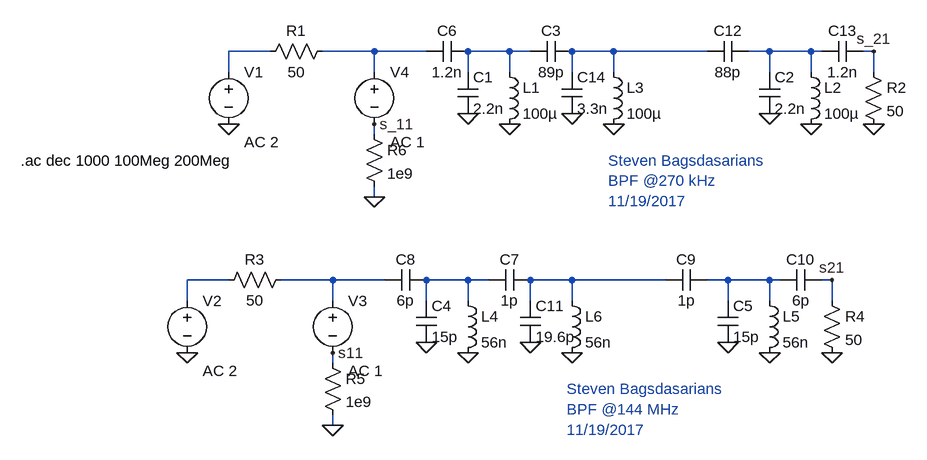
[diagram p0: schematic BPF_144MHz.asc]
BPF_144MHz.asc, the LTspice schematic file:
Version 4
SHEET 1 988 680
WIRE -96 -48 -160 -48
WIRE 64 -48 -16 -48
WIRE 144 -48 64 -48
WIRE 272 -48 208 -48
WIRE 304 -48 272 -48
WIRE 432 -48 368 -48
WIRE 576 -48 432 -48
WIRE 672 -48 640 -48
WIRE 736 -48 672 -48
WIRE 752 -48 736 -48
WIRE 832 -48 816 -48
WIRE -160 -16 -160 -48
WIRE 64 -16 64 -48
WIRE 208 -16 208 -48
WIRE 272 -16 272 -48
WIRE 368 -16 368 -48
WIRE 432 -16 432 -48
WIRE 672 -16 672 -48
WIRE 736 -16 736 -48
WIRE 832 -16 832 -48
WIRE 64 80 64 64
WIRE 64 176 64 160
WIRE -160 304 -224 304
WIRE 0 304 -80 304
WIRE 80 304 0 304
WIRE 208 304 144 304
WIRE 240 304 208 304
WIRE 368 304 304 304
WIRE 512 304 368 304
WIRE 608 304 576 304
WIRE 672 304 608 304
WIRE 688 304 672 304
WIRE 768 304 752 304
WIRE -224 336 -224 304
WIRE 0 336 0 304
WIRE 144 336 144 304
WIRE 208 336 208 304
WIRE 304 336 304 304
WIRE 368 336 368 304
WIRE 608 336 608 304
WIRE 672 336 672 304
WIRE 768 336 768 304
WIRE 0 432 0 416
WIRE 0 528 0 512
FLAG -224 416 0
FLAG 144 400 0
FLAG 208 416 0
FLAG 608 400 0
FLAG 672 416 0
FLAG 768 416 0
FLAG 304 400 0
FLAG 368 416 0
FLAG 0 528 0
FLAG 0 416 s11
FLAG 768 304 s21
FLAG -160 64 0
FLAG 208 48 0
FLAG 272 64 0
FLAG 672 48 0
FLAG 736 64 0
FLAG 832 64 0
FLAG 368 48 0
FLAG 432 64 0
FLAG 64 176 0
FLAG 64 64 s_11
FLAG 832 -48 s_21
SYMBOL ind 192 320 R0
SYMATTR InstName L4
SYMATTR Value 56n
SYMBOL ind 656 320 R0
SYMATTR InstName L5
SYMATTR Value 56n
SYMBOL cap 128 336 R0
SYMATTR InstName C4
SYMATTR Value 15p
SYMBOL cap 592 336 R0
SYMATTR InstName C5
SYMATTR Value 15p
SYMBOL res -176 320 R270
WINDOW 0 32 56 VTop 2
WINDOW 3 0 56 VBottom 2
SYMATTR InstName R3
SYMATTR Value 50
SYMBOL res 752 320 R0
SYMATTR InstName R4
SYMATTR Value 50
SYMBOL voltage -224 320 R0
WINDOW 123 24 124 Left 2
WINDOW 39 0 0 Left 2
SYMATTR Value2 AC 2
SYMATTR InstName V2
SYMATTR Value ""
SYMBOL cap 240 320 R270
WINDOW 0 32 32 VTop 2
WINDOW 3 0 32 VBottom 2
SYMATTR InstName C7
SYMATTR Value 1p
SYMBOL cap 80 320 R270
WINDOW 0 32 32 VTop 2
WINDOW 3 0 32 VBottom 2
SYMATTR InstName C8
SYMATTR Value 6p
SYMBOL cap 512 320 R270
WINDOW 0 32 32 VTop 2
WINDOW 3 0 32 VBottom 2
SYMATTR InstName C9
SYMATTR Value 1p
SYMBOL cap 688 320 R270
WINDOW 0 32 32 VTop 2
WINDOW 3 0 32 VBottom 2
SYMATTR InstName C10
SYMATTR Value 6p
SYMBOL ind 352 320 R0
SYMATTR InstName L6
SYMATTR Value 56n
SYMBOL cap 288 336 R0
SYMATTR InstName C11
SYMATTR Value 19.6p
SYMBOL voltage 0 320 R0
WINDOW 123 24 124 Left 2
WINDOW 39 0 0 Left 2
SYMATTR Value2 AC 1
SYMATTR InstName V3
SYMATTR Value ""
SYMBOL res -16 416 R0
SYMATTR InstName R5
SYMATTR Value 1e9
SYMBOL ind 256 -32 R0
SYMATTR InstName L1
SYMATTR Value 100µ
SYMBOL ind 720 -32 R0
SYMATTR InstName L2
SYMATTR Value 100µ
SYMBOL cap 192 -16 R0
SYMATTR InstName C1
SYMATTR Value 2.2n
SYMBOL cap 656 -16 R0
SYMATTR InstName C2
SYMATTR Value 2.2n
SYMBOL res -112 -32 R270
WINDOW 0 32 56 VTop 2
WINDOW 3 0 56 VBottom 2
SYMATTR InstName R1
SYMATTR Value 50
SYMBOL res 816 -32 R0
SYMATTR InstName R2
SYMATTR Value 50
SYMBOL voltage -160 -32 R0
WINDOW 123 24 124 Left 2
WINDOW 39 0 0 Left 2
SYMATTR Value2 AC 2
SYMATTR InstName V1
SYMATTR Value ""
SYMBOL cap 304 -32 R270
WINDOW 0 32 32 VTop 2
WINDOW 3 0 32 VBottom 2
SYMATTR InstName C3
SYMATTR Value 89p
SYMBOL cap 144 -32 R270
WINDOW 0 32 32 VTop 2
WINDOW 3 0 32 VBottom 2
SYMATTR InstName C6
SYMATTR Value 1.2n
SYMBOL cap 576 -32 R270
WINDOW 0 32 32 VTop 2
WINDOW 3 0 32 VBottom 2
SYMATTR InstName C12
SYMATTR Value 88p
SYMBOL cap 752 -32 R270
WINDOW 0 32 32 VTop 2
WINDOW 3 0 32 VBottom 2
SYMATTR InstName C13
SYMATTR Value 1.2n
SYMBOL ind 416 -32 R0
SYMATTR InstName L3
SYMATTR Value 100µ
SYMBOL cap 352 -16 R0
SYMATTR InstName C14
SYMATTR Value 3.3n
SYMBOL voltage 64 -32 R0
WINDOW 123 24 124 Left 2
WINDOW 39 0 0 Left 2
SYMATTR Value2 AC 1
SYMATTR InstName V4
SYMATTR Value ""
SYMBOL res 48 64 R0
SYMATTR InstName R6
SYMATTR Value 1e9
TEXT -480 120 Left 2 !.ac dec 1000 100Meg 200Meg
TEXT 360 472 Left 2 ;Steven Bagsdasarians\nBPF @144 MHz\n11/19/2017
TEXT 424 120 Left 2 ;Steven Bagsdasarians\nBPF @270 kHz\n11/19/2017

The netlist it stands for:
* BPF_144MHz.asc
L4 N008 0 56n
L5 N010 0 56n
C4 N008 0 15p
C5 N010 0 15p
R3 N006 N007 50
R4 s21 0 50
V2 N006 0 AC 2
C7 N008 N009 1p
C8 N007 N008 6p
C9 N009 N010 1p
C10 N010 s21 6p
L6 N009 0 56n
C11 N009 0 19.6p
V3 N007 s11 AC 1
R5 s11 0 1e9
L1 N003 0 100µ
L2 N005 0 100µ
C1 N003 0 2.2n
C2 N005 0 2.2n
R1 N001 N002 50
R2 s_21 0 50
V1 N001 0 AC 2
C3 N003 N004 89p
C6 N002 N003 1.2n
C12 N004 N005 88p
C13 N005 s_21 1.2n
L3 N004 0 100µ
C14 N004 0 3.3n
V4 N002 s_11 AC 1
R6 s_11 0 1e9
.ac dec 1000 100Meg 200Meg
* Steven Bagsdasarians
* BPF @144 MHz
* 11/19/2017
* Steven Bagsdasarians
* BPF @270 kHz
* 11/19/2017
.backanno
.end